# EasyEDA Pro project delay_module_easyeda.epro

# Schematic Schematic1
Board Name: Board1; Create Date: 2026-01-04; Page Name: P1; Project Name: delay module; Schematic Name: Schematic1; Update Date: 2026-01-04; Company: EasyEDA.com; Page Size: A4; Version: V1.0
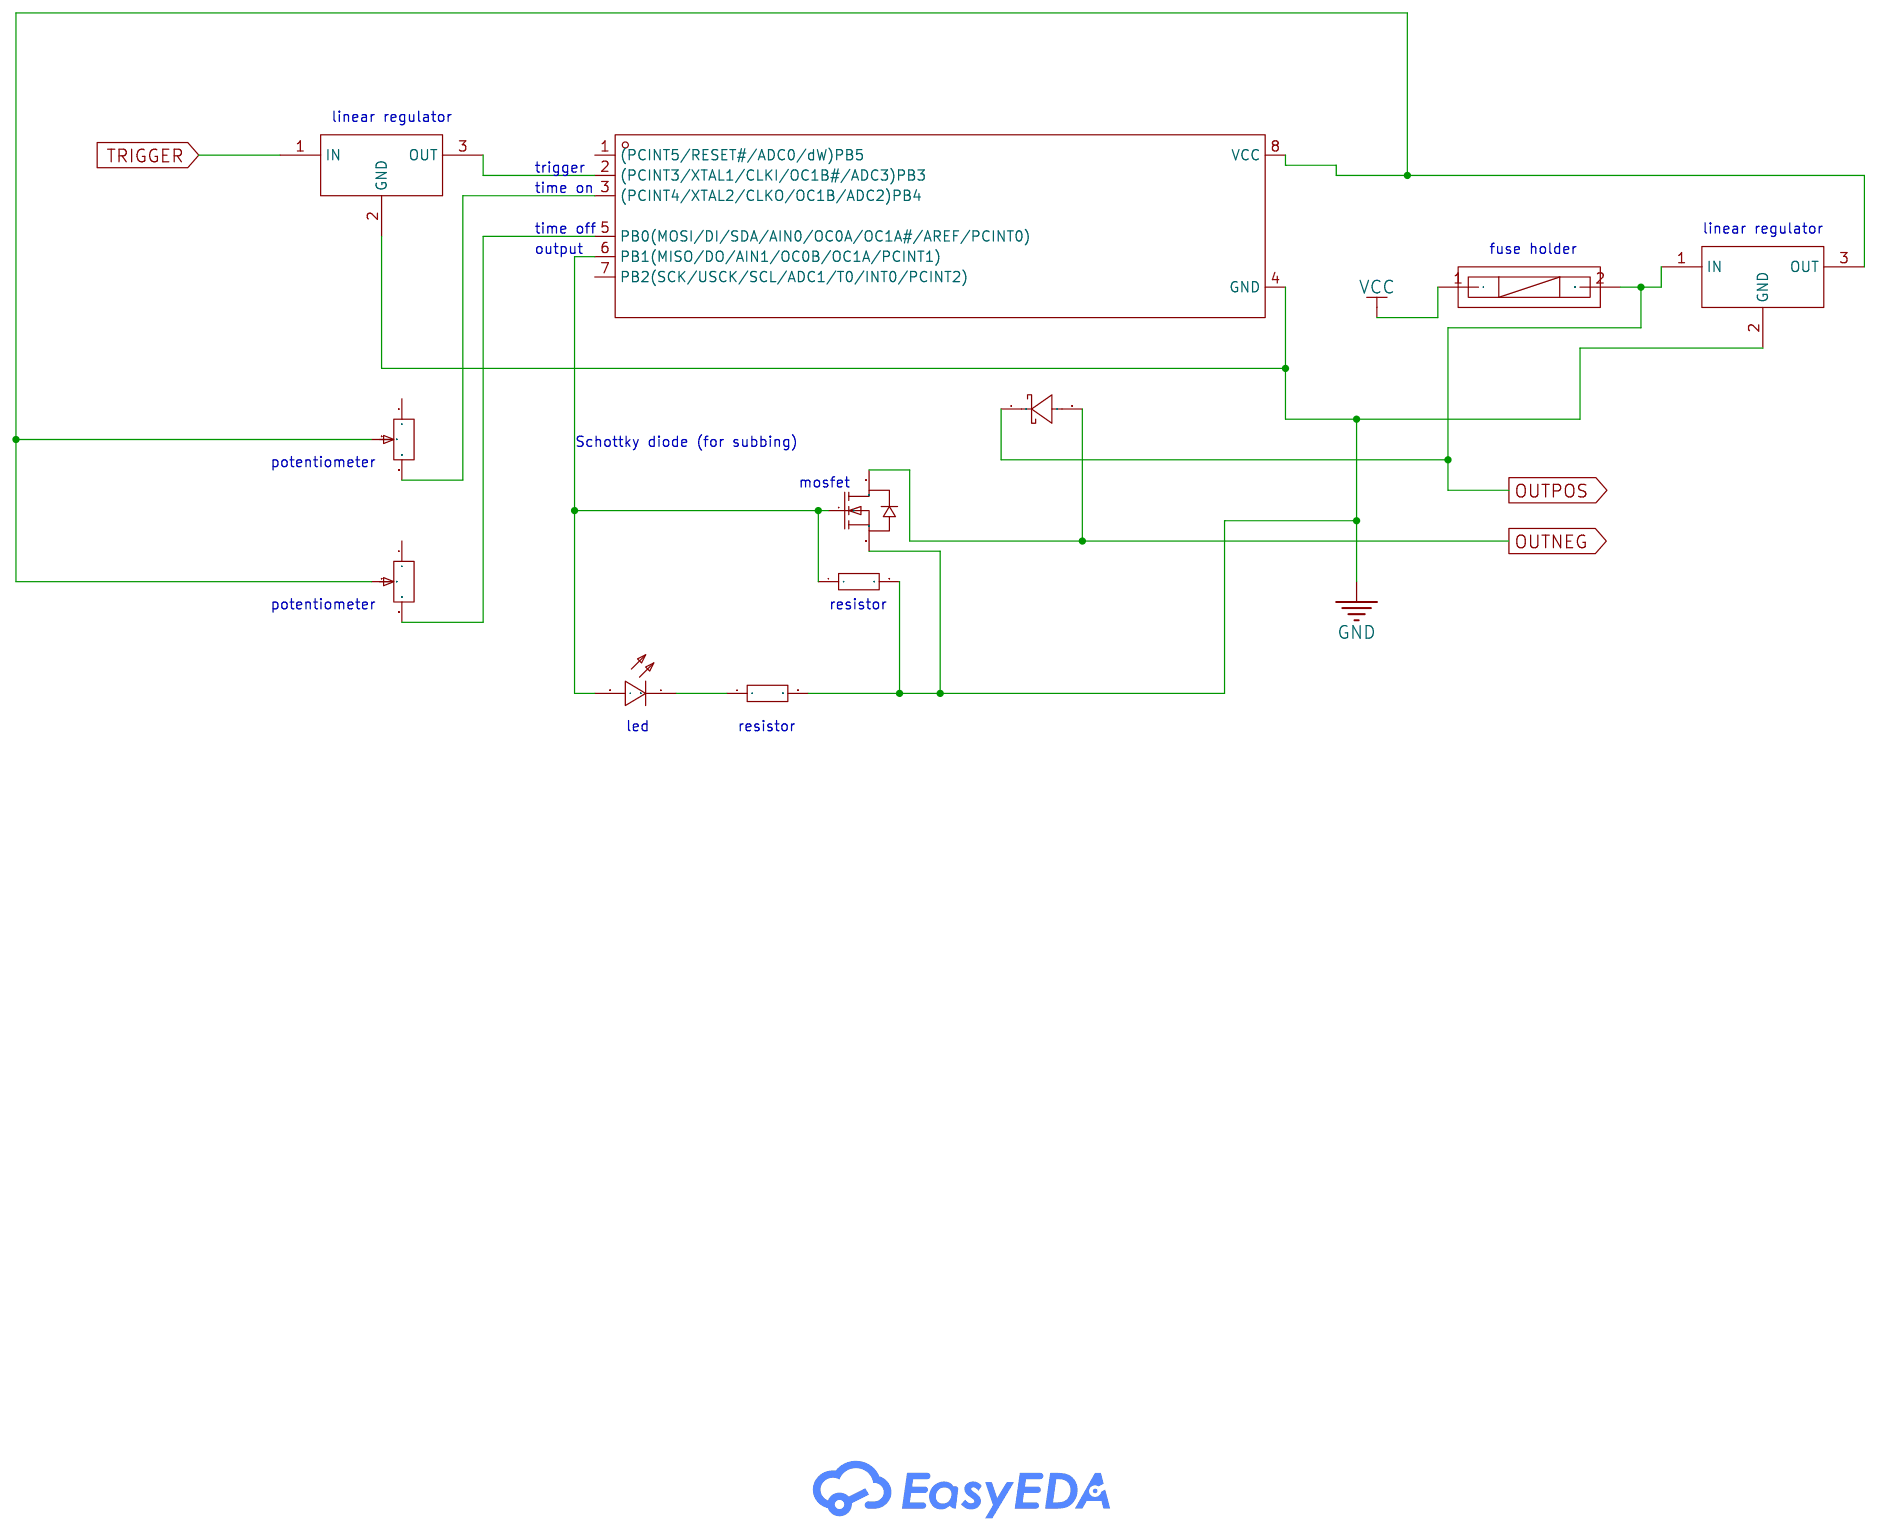
[diagram p0: schematic sheet]

## Parts
D1  1N5819  [DO-41_BD2.4-L4.7-P8.70-D0.8-RD]
F1  5x20 BLX-A型 保险丝支架 XC-7  [FUSE-TH_L22.6-W9.0]
IR1  IR908-7C(E5)  [LED-TH_L4.5-W1.5-P2.54-RD]
Q1  FQP30N06L-VB  [TO-220AB-3_L10.3-W5.0-P2.54-L]
R1  10K  [R0603]
R2  10kΩ  [RES-ADJ-TH_RK097111080J]
R3  10kΩ  [RES-ADJ-TH_RK097111080J]
R4  10K  [R0603]
U1  ATTINY85-20PU  [PDIP-8_L9.3-W6.4-P2.54-LS7.9-BL-1]
U2  L7805CV  [TO-220-3_L10.0-W4.5-P2.54-L]
U3  L7805CV  [TO-220-3_L10.0-W4.5-P2.54-L]

## Library data of the parts
D1 = 1N5819_C49318088: Voltage - Forward(Vf@If):600mV@1A Voltage - DC Reverse(Vr):40V Current - Rectified:1A Reverse Leakage Current (Ir):500uA Operating Junction Temperature Range:-55℃~+125℃ Operating Junction Temperature Range:-55℃~+125℃ Non-Repetitive Peak Forward Surge Curr; LCSC Part Name: 肖特基二极管; Supplier Part: C49318088; Manufacturer: luJing(鲁晶); Supplier Footprint: DO-41; JLCPCB Part Class: Extended Part; Datasheet: https://item.szlcsc.com/datasheet/1N5819/51789330.html; Supplier: LCSC; Voltage - Forward(Vf@If): 600mV@1A; Voltage - DC Reverse(Vr): 40V; Current - Rectified: 1A; Reverse Leakage Current (Ir): 500uA; Operating Junction Temperature Range: -55℃~+125℃; Non-Repetitive Peak Forward Surge Current: 25A
F1 = 5x20 BLX-A型 保险丝支架 XC-7: Fuseholder Type:Bracket type Number of Circuits:1 Voltage Rating:250V Current Rating:6.3A Fuse Type:Cylindrical Fuse Diameter (φD):5.2mm Fuse Length:20mm; LCSC Part Name: 保险丝座 5x20 BLX-A型; Supplier Part: C3131; Manufacturer: xcfuse(旭程); Supplier Footprint: 插件; JLCPCB Part Class: Extended Part; Datasheet: https://item.szlcsc.com/datasheet/5x20%2520BLX-A%25E5%259E%258B%2520%25E4%25BF%259D%25E9%2599%25A9%25E4%25B8%259D%25E6%2594%25AF%25E6%259E%25B6%2520XC-7/3520.html; Supplier: LCSC; Fuseholder Type: Bracket type; Number of Circuits: 1; Voltage Rating: 250V; Current Rating: 6.3A; Fuse Type: Cylindrical; Fuse Diameter (φD): 5.2mm; Fuse Length: 20mm
IR1 = IR908-7C(E5): Radiant Intensity:; Supplier Part: C72054; Manufacturer: EVERLIGHT(亿光); Supplier Footprint: 插件,L=4.5mm; JLCPCB Part Class: Extended Part; Datasheet: https://atta.szlcsc.com/upload/public/pdf/source/20160507/1462613614332.pdf; Supplier: LCSC
Q1 = FQP30N06L-VB: Number:One N-channel Drain to Source Voltage:60V Current - Continuous Drain(Id):50A RDS(on):24mΩ@10V Pd - Power Dissipation:150W Gate Threshold Voltage (Vgs(th)):4V Gate Charge(Qg):28nC@10V Input Capacitance(Ciss):1.3nF@25V Reverse Transfer Capacitance (C; LCSC Part Name: 1个N沟道 耐压:60V 电流:50A; Supplier Part: C878826; Manufacturer: VBsemi(微碧半导体); Supplier Footprint: TO-220AB; JLCPCB Part Class: Extended Part; Datasheet: https://item.szlcsc.com/datasheet/FQP30N06L-VB/938801.html; Supplier: LCSC; Number: One N-channel; Drain to Source Voltage: 60V; Current - Continuous Drain(Id): 50A; RDS(on): 24mΩ@10V; Pd - Power Dissipation: 150W; Gate Threshold Voltage (Vgs(th)): 4V; Gate Charge(Qg): 28nC@10V; Input Capacitance(Ciss): 1.3nF@25V; Reverse Transfer Capacitance (Crss@Vds): 110pF@25V; Operating Temperature: -55℃~+175℃; Type: N-Channel
R1 R4 = Res_0603: Supplier Footprint: 0603
R2 R3 = RK097111080J: Resistance:10kΩ; LCSC Part Name: 三件套 10kΩ 旋转电位器，水平安装，螺纹固定，总阻值10kΩ; Supplier Part: C97444; Manufacturer: ALPSALPINE(阿尔卑斯阿尔派); Supplier Footprint: 插件; JLCPCB Part Class: Extended Part; Datasheet: https://atta.szlcsc.com/upload/public/pdf/source/20170325/1490427936259.pdf; Supplier: LCSC
U1 = ATTINY85-20PU: CPU Core:AVR CPU Maximum Speed:20MHz Program Storage Size:8KB Program Memory Type:FLASH EEPROM:512Byte Number of I/O:6 ADC (Bit):10bit Voltage - Supply:2.7V~5.5V Voltage - Supply:2.7V~5.5V Applications:-; Supplier Part: C965497; Manufacturer: MICROCHIP(美国微芯); Supplier Footprint: PDIP-8; JLCPCB Part Class: Extended Part; Datasheet: https://item.szlcsc.com/datasheet/ATTINY85-20PU/1052792.html; Supplier: LCSC; CPU Core: AVR; CPU Maximum Speed: 20MHz; Program Storage Size: 8KB; Program Memory Type: FLASH; EEPROM: 512Byte; Number of I/O: 6; ADC (Bit): 10bit; Voltage - Supply: 2.7V~5.5V
U2 U3 = L7805CV_C6430948: Output Type:Fixed Voltage - Supply:20V Output Voltage:5V Output Voltage:5V Output Current:1.5A Voltage Dropout:100mV@(1A) standby current:9mA Features:Short Circuit Protection；Over Temperature Protection Operating Temperature:0℃~+125℃ Operating Temperatur; LCSC Part Name: 线性稳压器 1.5A 5V; Supplier Part: C6430948; Manufacturer: GOODWORK(固得沃克); Supplier Footprint: TO-220AB; JLCPCB Part Class: Extended Part; Datasheet: https://item.szlcsc.com/datasheet/L7805CV/7383833.html; Supplier: LCSC; Output Type: Fixed; Voltage - Supply: 20V; Output Voltage: 5V; Output Current: 1.5A; Voltage Dropout: 100mV@(1A); standby current: 9mA; Features: Short Circuit Protection；Over Temperature Protection; Operating Temperature: 0℃~+125℃; Output Configuration: Positive; Number of Outputs: 1

## Nets
GND: Q1.3(S) R1.2 R4.2 U1.4(GND) U2.2(GND) U3.2(GND)
VCC: F1.1
OUTNEG: D1.2(A) Q1.2(D)
OUTPOS: D1.1(C) F1.2 U3.1(IN)
TRIGGER: U2.1(IN)
Net-(IR1-1): IR1.1(C) R4.1
Net-(IR1-2): IR1.2(A) Q1.1(G) R1.1 U1.6(PB1(MISO/DO/AIN1/OC0B/OC1A/PCINT1))
Net-(R2-2): R2.2 R3.2 U1.8(VCC) U3.3(OUT)
Net-(R2-3): R2.3 U1.3((PCINT4/XTAL2/CLKO/OC1B/ADC2)PB4)
Net-(R3-3): R3.3 U1.5(PB0(MOSI/DI/SDA/AIN0/OC0A/OC1A#/AREF/PCINT0))
Net-(U1-2): U1.2((PCINT3/XTAL1/CLKI/OC1B#/ADC3)PB3) U2.3(OUT)

Not connected (* = marked no-connect by the designer): R2 1; R3 1; U1 1((PCINT5/RESET#/ADC0/dW)PB5) 7(PB2(SCK/USCK/SCL/ADC1/T0/INT0/PCINT2))

## Notes on the sheet
- linear regulator
- trigger
- time on
- time off
- linear regulator
- output
- fuse holder
- Schottky diode (for subbing)
- potentiometer
- mosfet
- potentiometer
- resistor
- led
- resistor

# Board boardver1
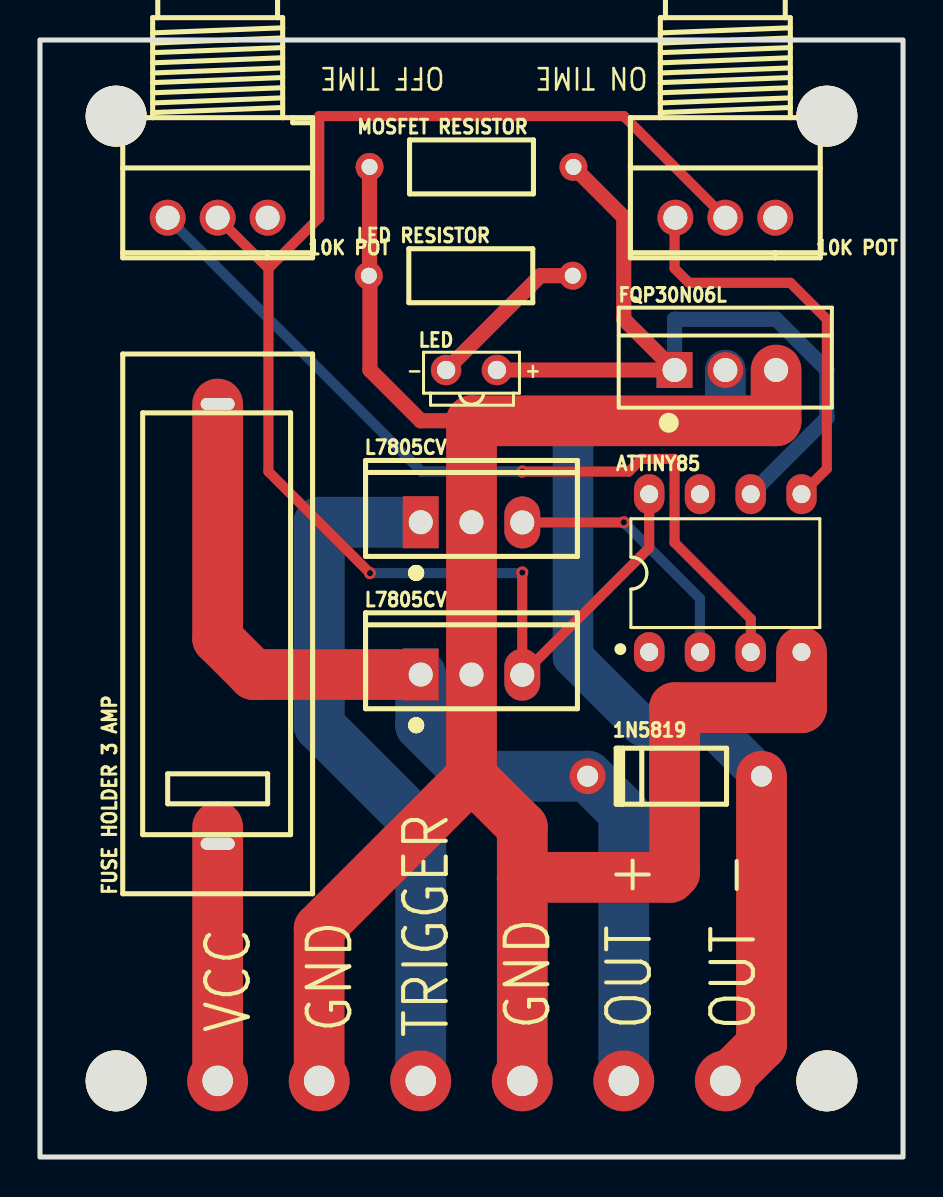
[diagram p1: board, top side]
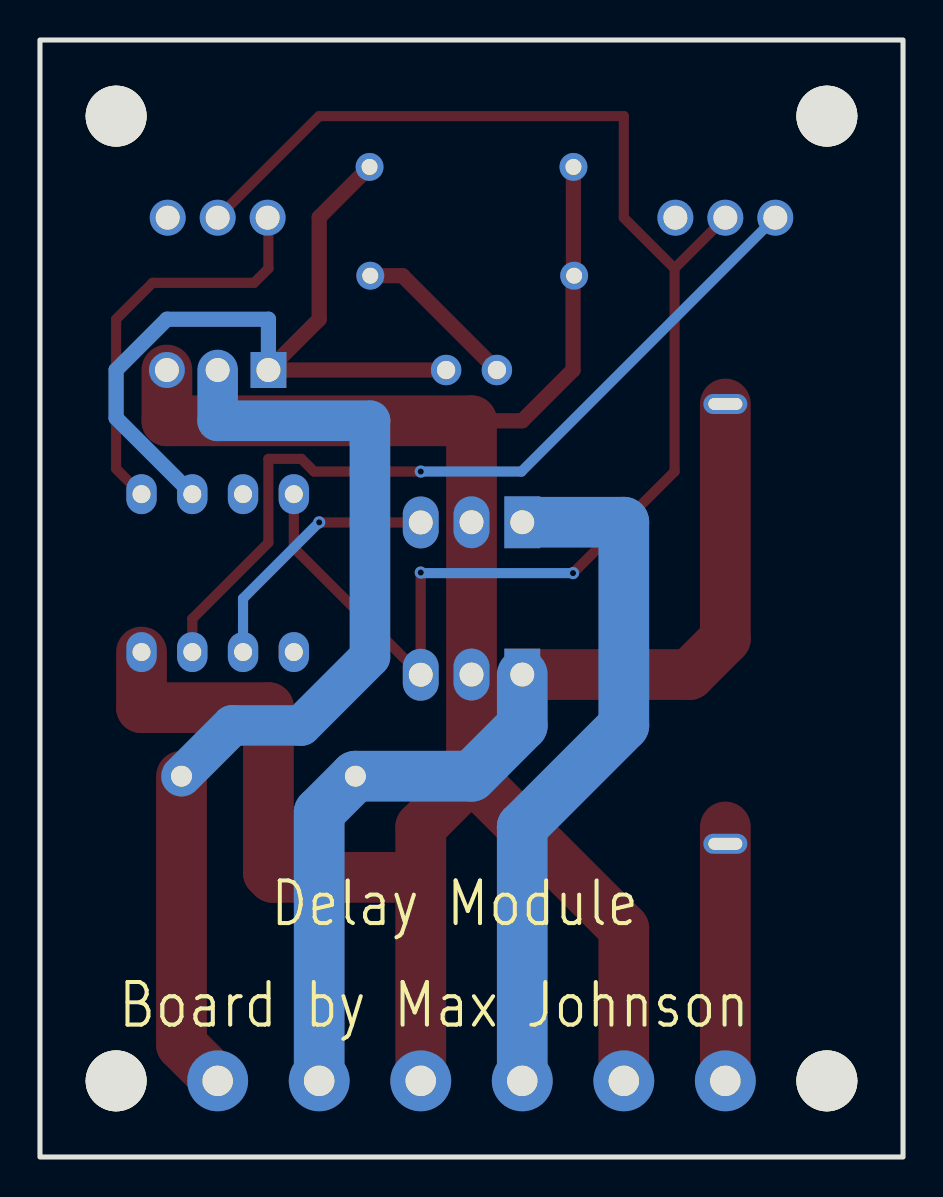
[diagram p2: board, bottom side, seen from below]

Outline 43.18 x 55.88 mm; copper layers: Top Layer, Bottom Layer. Coordinates in mm from the lower left corner of the outline.
Outline path: rectangle 0,55.88 43.18,0
Stack: Top Layer 0.035mm / Dielectric1 1.51mm FR4 er 4.5 / Bottom Layer 0.035mm

## Design rules (mm)
template: JLCPCB Capability(Two Layers Board)
spacing copperThickness1oz (default): track to track 0.102, other pairs 0.152 to 0.3
spacing copperThickness2oz: track to track 0.203, other pairs 0.152 to 0.3
track width copperThickness1oz (default): min 0.127, default 0.254, max 2.54
track width copperThickness2oz: min 0.203, default 0.254, max 2.54
differential pair differentialPair (default): width min 0.127, default 0.254, max 2.54; gap min 0.152, default 0.152
via viaSize (default): diameter min 0.5, default 0.61, max 10; hole min 0.3, default 0.305, max 6.3

## Placement (name value [footprint] x y rotation side)
1N5819  1N5819  [DO-41_BD2.4-L4.7-P8.70-D0.8-RD]  31.75 19.05 0 top
10K POT  -  [RES-ADJ-TH_RK097111080J]  8.89 46.99 180 top
10K POT#2  -  [RES-ADJ-TH_RK097111080J]  34.29 46.99 180 top
ATTINY85  ATTINY85-20PU  [PDIP-8_L9.3-W6.4-P2.54-LS7.9-BL-1]  34.29 29.21 0 top
FQP30N06L  FQP30N06L-VB  [TO-220AB-3_L10.3-W5.0-P2.54-L]  34.29 39.37 0 top
FUSE HOLDER 3 AMP  5x20 BLX-A型 保险丝支架 XC-7  [FUSE-TH_L22.6-W9.0]  8.89 26.67 90 top
L7805CV  -  [TO-220-3_L10.0-W4.5-P2.54-L]  21.59 24.13 0 top
L7805CV#2  -  [TO-220-3_L10.0-W4.5-P2.54-L]  21.59 31.75 0 top
LED  IR908-7C(E5)  [LED-TH_L4.5-W1.5-P2.54-RD]  21.59 39.37 0 top
LED RESISTOR  10kΩ  [RES-TH_BD2.7-L6.2-P10.20-D0.4]  21.55 44.09 0 top
MOSFET RESISTOR  10kΩ  [RES-TH_BD2.7-L6.2-P10.20-D0.4]  21.59 49.53 0 top
NOREF  -  [Pad_e15]  29.21 3.81 0 top
NOREF#2  -  [Pad_e13]  19.05 3.81 0 top
NOREF#3  -  [Pad_e12]  13.97 3.81 0 top
NOREF#4  -  [Pad_e14]  24.13 3.81 0 top
NOREF#5  -  [Pad_e421]  39.37 3.81 0 top
NOREF#6  -  [Pad_e419]  39.37 52.07 0 top
NOREF#7  -  [Pad_e25]  34.29 3.81 0 top
NOREF#8  -  [Pad_e418]  3.81 52.07 0 top
NOREF#9  -  [Pad_e11]  8.89 3.81 0 top
NOREF#10  -  [Pad_e420]  3.81 3.81 0 top

## Footprints (pads in the part's own frame, mm; a bottom-side part is the same pattern mirrored in y, then rotated)
DO-41_BD2.4-L4.7-P8.70-D0.8-RD
  round 1.8 hole 1.05: 1(-4.35,0) 2(4.35,0)
FUSE-TH_L22.6-W9.0
  oval 1x2.2 hole 0.6x1.7: 1(-11,0) 2(11,0)
LED-TH_L4.5-W1.5-P2.54-RD
  round 1.524 hole 0.914: 1(-1.27,0) 2(1.27,0)
Pad_e11
  round 3.048 hole 1.524: 1(0,0)
Pad_e12
  round 3.048 hole 1.524: 2(0,0)
Pad_e13
  round 3.048 hole 1.524: 3(0,0)
Pad_e14
  round 3.048 hole 1.524: 4(0,0)
Pad_e15
  round 3.048 hole 1.524: 5(0,0)
Pad_e25
  round 3.048 hole 1.524: 6(0,0)
Pad_e418
  round 3.048 hole 3.048: 1(0,0)
Pad_e419
  round 3.048 hole 3.048: 2(0,0)
Pad_e420
  round 3.048 hole 3.048: 3(0,0)
Pad_e421
  round 3.048 hole 3.048: 4(0,0)
PDIP-8_L9.3-W6.4-P2.54-LS7.9-BL-1
  oval 1.524x2 hole 0.9: 1(-3.81,-3.95) 2(-1.27,-3.95) 3(1.27,-3.95) 4(3.81,-3.95) 5(3.81,3.95) 6(1.27,3.95) 7(-1.27,3.95) 8(-3.81,3.95)
RES-ADJ-TH_RK097111080J
  round 1.8 hole 1.2: 1(-2.5,0) 2(0,0) 3(2.5,0)
RES-TH_BD2.7-L6.2-P10.20-D0.4
  round 1.4 hole 0.8: 1(-5.1,0) 2(5.1,0)
TO-220-3_L10.0-W4.5-P2.54-L
  rect 1.8x2.6 hole 1.2: 1(-2.54,0.005)
  oval 1.8x2.6 hole 1.2: 2(0,0.005) 3(2.54,-0.005)
TO-220AB-3_L10.3-W5.0-P2.54-L
  rect 1.8x1.8 hole 1.2: 1(-2.54,0)
  round 1.8 hole 1.2: 2(0,0) 3(2.54,0)

## Nets
VCC: FUSE HOLDER 3 AMP.1
OUTNEG: 1N5819.2 ATTINY85.4 FQP30N06L.2 FQP30N06L.3 L7805CV.2 L7805CV#2.2 NOREF#3.2 NOREF#4.4 NOREF#7.6
OUTPOS: 1N5819.1 FUSE HOLDER 3 AMP.2 L7805CV.1 NOREF.5
TRIGGER: L7805CV#2.1 NOREF#2.3
$1N1277: 10K POT.2 10K POT#2.2 ATTINY85.8 L7805CV.3
$1N1425: ATTINY85.2 L7805CV#2.3
$1N1430: 10K POT.3 ATTINY85.3
$1N1436: 10K POT#2.3 ATTINY85.5
$1N1491: ATTINY85.6 FQP30N06L.1 LED.2
$1N1583: LED.1

Pads without a net: 10K POT 1; 10K POT#2 1; ATTINY85 1 7; LED RESISTOR 1 2; MOSFET RESISTOR 1 2; NOREF#5 4; NOREF#6 2; NOREF#8 1; NOREF#9 1; NOREF#10 3

## Via types
v1: diameter 0.61, hole 0.305, Top Layer to Bottom Layer, 5 vias

## Routing (per net, layer and track width the routed paths; a pad name or vN(x,y) marks a point on that pad's centre or on a via; arc(x,y) is an arc through that point)
GND: length 95.4
  Top Layer w2.54: 24.13,13.99 24.13,16.51 21.59,19.05 ; 24.13,13.99 24.13,3.81 ; 24.13,13.99 31.53,13.99 31.75,14.21 31.75,22.48 38.1,22.48 38.1,25.26 ; 21.59,19.05 13.97,11.43 13.97,3.81 ; 21.59,19.05 21.59,36.83 36.83,36.83 36.83,39.37
(no net): length 29
  Top Layer w0.762: MOSFET RESISTOR.1 16.49,44.05 16.51,44.03 16.51,39.37 19.05,36.83 21.59,36.83
  Top Layer w2.54: NOREF#9.1 8.89,16.51
OUTNEG: length 49.9
  Top Layer w2.54: 1N5819.2 36.1,5.62 NOREF#7.6
  Bottom Layer w2.032: 1N5819.2 33.56,21.59 30.1,21.59 26.67,25.02 26.67,36.83 34.29,36.83 FQP30N06L.2
OUTPOS: length 49.6
  Top Layer w2.54: FUSE HOLDER 3 AMP.2 8.89,25.93 10.69,24.14 18.03,24.14
  Bottom Layer w2.54: NOREF.5 29.21,17.24 1N5819.1 21.59,19.05 19.05,21.59 L7805CV.1
TRIGGER: length 34.1
  Bottom Layer w2.54: 18.03,31.76 13.97,31.76 13.97,21.59 19.05,16.51 NOREF#2.3
$1N1277: length 76.4
  Top Layer w0.508: ATTINY85.8 30.48,30.48 L7805CV.3 v1(24.13,29.24) ; 10K POT#2.2 29.21,52.07 13.97,52.07 13.97,46.99 11.43,44.45 ; 11.43,44.45 10K POT.2 ; 11.43,44.45 11.43,34.29 v1(16.51,29.21)
  Bottom Layer w0.508: v1(16.51,29.21) 24.1,29.21 v1(24.13,29.24)
$1N1425: length 13.2
  Top Layer w0.508: v1(29.21,31.75) 29.2,31.75 L7805CV#2.3
  Bottom Layer w0.508: ATTINY85.2 33.02,27.94 v1(29.21,31.75)
$1N1430: length 42.1
  Top Layer w0.508: v1(24.13,34.29) 29.46,34.29 30.1,34.93 31.75,34.93 31.75,30.73 35.56,26.92 ATTINY85.3
  Bottom Layer w0.508: 10K POT.3 19.09,34.29 v1(24.13,34.29)
$1N1436: length 20.5
  Top Layer w0.508: 10K POT#2.3 31.75,46.95 31.75,44.45 32.47,43.73 37.55,43.73 39.37,41.91 39.37,34.43 ATTINY85.5
$1N1491: length 40.1
  Top Layer w0.762: LED.2 FQP30N06L.1 29.21,41.91 29.21,47.01 26.69,49.53
  Bottom Layer w0.762: FQP30N06L.1 31.75,41.91 36.83,41.91 39.37,39.37 39.37,36.97 ATTINY85.6
$1N1583: length 8.3
  Top Layer w0.762: LED.1 25.04,44.09 v1(26.66,44.09)

## Text on the board
Bottom Silkscreen Layer: Delay Module | Board by Max Johnson
Top Silkscreen Layer: - | + | ON TIME | OFF TIME | VCC | GND | TRIGGER | OUT + | OUT -

# Board boardver2
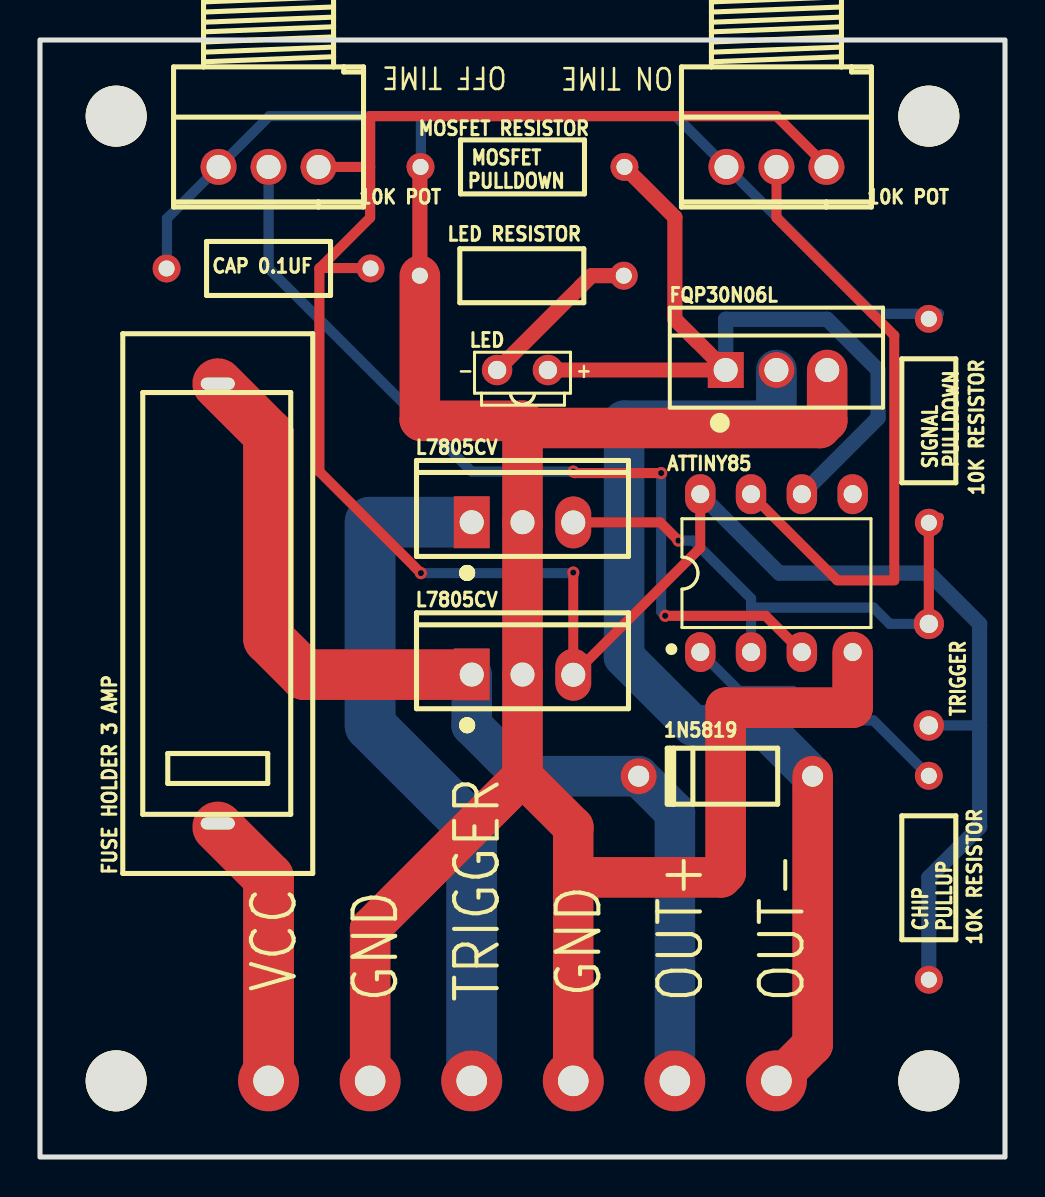
[diagram p3: board, top side]
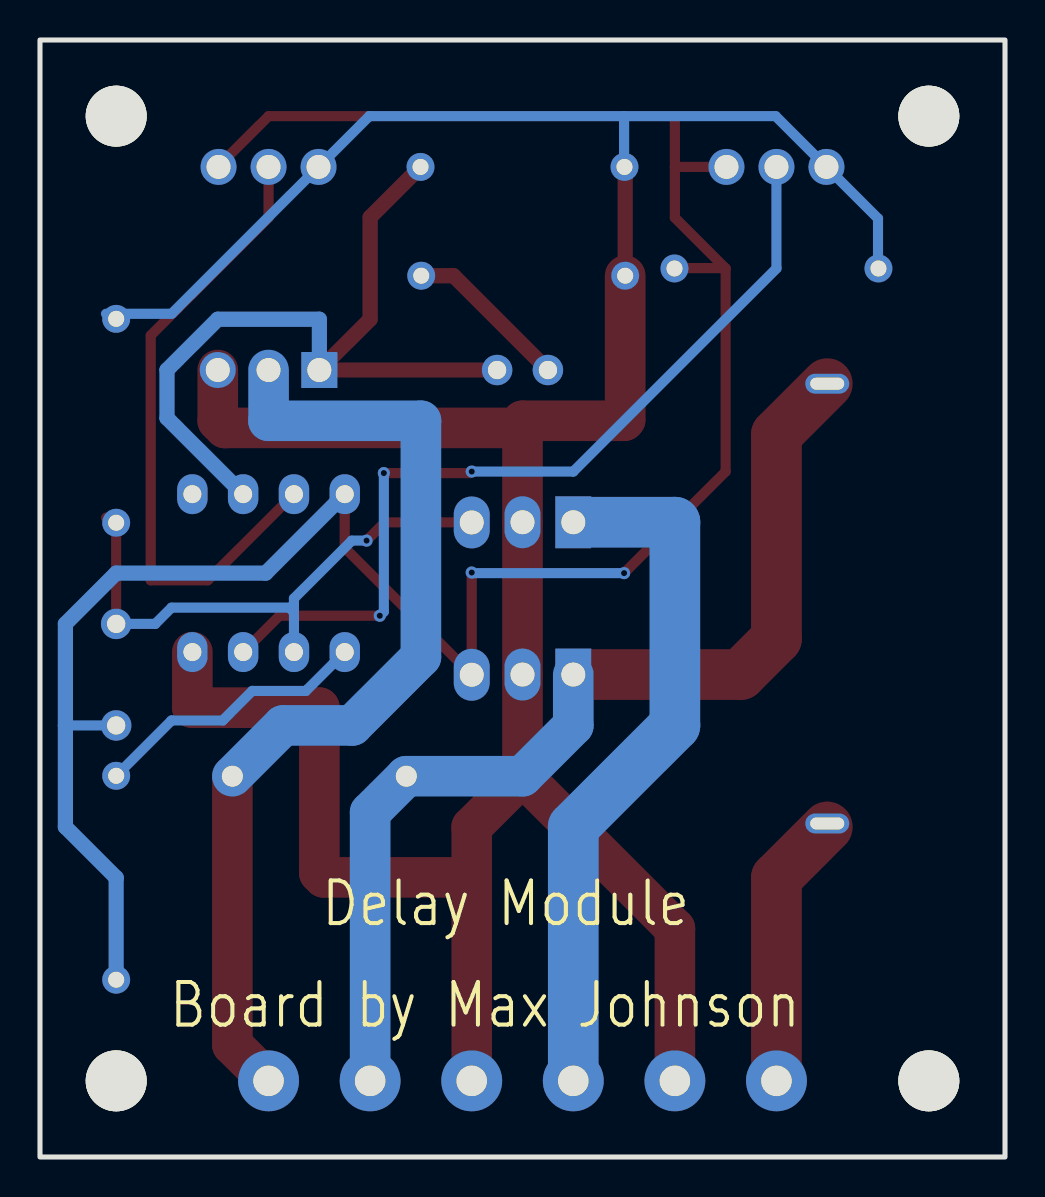
[diagram p4: board, bottom side, seen from below]

Outline 48.26 x 55.88 mm; copper layers: Top Layer, Bottom Layer. Coordinates in mm from the lower left corner of the outline.
Outline path: rectangle 0,55.88 48.26,0
Stack: Top Layer 0.035mm / Dielectric1 1.51mm FR4 er 4.5 / Bottom Layer 0.035mm

## Design rules (mm)
template: JLCPCB Capability(Two Layers Board)
spacing copperThickness1oz (default): track to track 0.102, other pairs 0.152 to 0.3
spacing copperThickness2oz: track to track 0.203, other pairs 0.152 to 0.3
track width copperThickness1oz (default): min 0.127, default 0.254, max 2.54
track width copperThickness2oz: min 0.203, default 0.254, max 2.54
differential pair differentialPair (default): width min 0.127, default 0.254, max 2.54; gap min 0.152, default 0.152
via viaSize (default): diameter min 0.5, default 0.61, max 10; hole min 0.3, default 0.305, max 6.3

## Placement (name value [footprint] x y rotation side)
1N5819  1N5819  [DO-41_BD2.4-L4.7-P8.70-D0.8-RD]  34.29 19.05 0 top
10K POT  -  [RES-ADJ-TH_RK097111080J]  36.83 49.53 180 top
10K POT#2  -  [RES-ADJ-TH_RK097111080J]  11.43 49.53 180 top
10K RESISTOR  -  [RES-TH_BD2.7-L6.2-P10.20-D0.4]  44.45 13.97 90 top
10K RESISTOR#2  -  [RES-TH_BD2.7-L6.2-P10.20-D0.4]  44.45 36.83 90 top
ATTINY85  ATTINY85-20PU  [PDIP-8_L9.3-W6.4-P2.54-LS7.9-BL-1]  36.83 29.21 0 top
CAP 0.1UF  10kΩ  [RES-TH_BD2.7-L6.2-P10.20-D0.4]  11.43 44.45 0 top
FQP30N06L  FQP30N06L-VB  [TO-220AB-3_L10.3-W5.0-P2.54-L]  36.83 39.37 0 top
FUSE HOLDER 3 AMP  5x20 BLX-A型 保险丝支架 XC-7  [FUSE-TH_L22.6-W9.0]  8.89 27.69 90 top
L7805CV  -  [TO-220-3_L10.0-W4.5-P2.54-L]  24.13 24.13 0 top
L7805CV#2  -  [TO-220-3_L10.0-W4.5-P2.54-L]  24.13 31.75 0 top
LED  IR908-7C(E5)  [LED-TH_L4.5-W1.5-P2.54-RD]  24.13 39.37 0 top
LED RESISTOR  10kΩ  [RES-TH_BD2.7-L6.2-P10.20-D0.4]  24.09 44.09 0 top
MOSFET RESISTOR  10kΩ  [RES-TH_BD2.7-L6.2-P10.20-D0.4]  24.13 49.53 0 top
NOREF  -  [Pad_e25]  36.83 3.81 0 top
NOREF#2  -  [Pad_e13]  21.59 3.81 0 top
NOREF#3  -  [Pad_e4]  44.45 26.67 0 top
NOREF#4  -  [Pad_e15]  31.75 3.81 0 top
NOREF#5  -  [Pad_e11]  11.43 3.81 0 top
NOREF#6  -  [Pad_e421]  44.45 3.81 0 top
NOREF#7  -  [Pad_e12]  16.51 3.81 0 top
NOREF#8  -  [Pad_e420]  3.81 3.81 0 top
NOREF#9  -  [Pad_e418]  3.81 52.07 0 top
NOREF#10  -  [Pad_e419]  44.45 52.07 0 top
NOREF#11  -  [Pad_e14]  26.67 3.81 0 top
NOREF#12  -  [Pad_e7]  44.45 21.59 0 top

## Footprints (pads in the part's own frame, mm; a bottom-side part is the same pattern mirrored in y, then rotated)
DO-41_BD2.4-L4.7-P8.70-D0.8-RD
  round 1.8 hole 1.05: 1(-4.35,0) 2(4.35,0)
FUSE-TH_L22.6-W9.0
  oval 1x2.2 hole 0.6x1.7: 1(-11,0) 2(11,0)
LED-TH_L4.5-W1.5-P2.54-RD
  round 1.524 hole 0.914: 1(-1.27,0) 2(1.27,0)
Pad_e4
  round 1.524 hole 0.914: 1(0,0)
Pad_e7
  round 1.524 hole 0.914: 2(0,0)
Pad_e11
  round 3.048 hole 1.524: 1(0,0)
Pad_e12
  round 3.048 hole 1.524: 2(0,0)
Pad_e13
  round 3.048 hole 1.524: 3(0,0)
Pad_e14
  round 3.048 hole 1.524: 4(0,0)
Pad_e15
  round 3.048 hole 1.524: 5(0,0)
Pad_e25
  round 3.048 hole 1.524: 6(0,0)
Pad_e418
  round 3.048 hole 3.048: 1(0,0)
Pad_e419
  round 3.048 hole 3.048: 2(0,0)
Pad_e420
  round 3.048 hole 3.048: 3(0,0)
Pad_e421
  round 3.048 hole 3.048: 4(0,0)
PDIP-8_L9.3-W6.4-P2.54-LS7.9-BL-1
  oval 1.524x2 hole 0.9: 1(-3.81,-3.95) 2(-1.27,-3.95) 3(1.27,-3.95) 4(3.81,-3.95) 5(3.81,3.95) 6(1.27,3.95) 7(-1.27,3.95) 8(-3.81,3.95)
RES-ADJ-TH_RK097111080J
  round 1.8 hole 1.2: 1(-2.5,0) 2(0,0) 3(2.5,0)
RES-TH_BD2.7-L6.2-P10.20-D0.4
  round 1.4 hole 0.8: 1(-5.1,0) 2(5.1,0)
TO-220-3_L10.0-W4.5-P2.54-L
  rect 1.8x2.6 hole 1.2: 1(-2.54,0.005)
  oval 1.8x2.6 hole 1.2: 2(0,0.005) 3(2.54,-0.005)
TO-220AB-3_L10.3-W5.0-P2.54-L
  rect 1.8x1.8 hole 1.2: 1(-2.54,0)
  round 1.8 hole 1.2: 2(0,0) 3(2.54,0)

## Nets
5V POWER: 10K POT.1 10K POT#2.1 10K RESISTOR.1 ATTINY85.8 CAP 0.1UF.2 L7805CV.3 NOREF#12.2
GND: 10K POT.3 10K POT#2.3 10K RESISTOR#2.2 ATTINY85.4 CAP 0.1UF.1 FQP30N06L.3 L7805CV.2 L7805CV#2.2 LED RESISTOR.1 MOSFET RESISTOR.1 NOREF#7.2 NOREF#11.4
FUSED_POWER: 1N5819.1 FUSE HOLDER 3 AMP.2 L7805CV.1 NOREF#4.5
INPUT_POWER: FUSE HOLDER 3 AMP.1 NOREF#5.1
LED_GND: LED.1 LED RESISTOR.2
OFF_TIME_SENSOR: 10K POT#2.2 ATTINY85.3
ON_TIME_SENSOR: 10K POT.2 ATTINY85.7
OUTNEG: 1N5819.2 FQP30N06L.2 NOREF.6
OUTPUT_CONTROL: ATTINY85.6 FQP30N06L.1 LED.2 MOSFET RESISTOR.2
PULLUP: 10K RESISTOR.2 ATTINY85.1
SIGNAL: 10K RESISTOR#2.1 ATTINY85.2 L7805CV#2.3 NOREF#3.1
TRIGGER: L7805CV#2.1 NOREF#2.3
UNUSED: ATTINY85.5

Pads without a net: NOREF#6 4; NOREF#8 3; NOREF#9 1; NOREF#10 2

## Via types
v1: diameter 0.61, hole 0.305, Top Layer to Bottom Layer, 6 vias

## Routing (per net, layer and track width the routed paths; a pad name or vN(x,y) marks a point on that pad's centre or on a via; arc(x,y) is an arc through that point)
5V POWER: length 117.5
  Top Layer w0.508: 39.37,49.53 36.83,52.07 16.51,52.07 16.51,49.53 ; CAP 0.1UF.2 16.51,44.47 13.99,44.47 ; 10K POT#2.1 16.51,49.53 ; 16.51,49.53 16.51,46.99 13.99,44.47 ; v1(26.67,29.24) L7805CV.3 33.02,30.48 ATTINY85.8 ; 13.99,44.47 13.97,44.45 13.97,34.29 v1(19.05,29.21)
  Bottom Layer w0.508: NOREF#12.2 46.99,21.59 ; v1(26.67,29.24) 26.64,29.21 v1(19.05,29.21)
  Bottom Layer w0.762: 44.45,8.89 44.45,13.98 46.99,16.52 46.99,26.67 44.45,29.21 36.97,29.21 ATTINY85.8
GND: length 163.2
  Top Layer w0.762: 18.99,49.53 LED RESISTOR.1
  Top Layer w2.032: FQP30N06L.3 39.37,36.83 39.01,36.47 24.13,36.47 ; 26.67,13.99 26.67,16.51 24.13,19.05 ; 26.67,13.99 34.07,13.99 34.29,14.21 34.29,22.48 40.64,22.48 ATTINY85.4 ; 26.67,13.99 NOREF#11.4 ; 24.13,19.05 16.51,11.43 NOREF#7.2 ; 24.13,19.05 L7805CV.2 L7805CV#2.2 24.13,36.83 19.05,36.83 18.99,36.89 LED RESISTOR.1
  Bottom Layer w0.508: 6.35,44.45 6.35,46.95 10K POT#2.3 11.47,52.07 19.05,52.07 ; 19.05,52.07 31.79,52.07 10K POT.3 41.68,42.18 44.96,42.18 ; 19.05,52.07 19.05,49.55 MOSFET RESISTOR.1
FUSED_POWER: length 51.6
  Top Layer w2.54: 20.57,24.14 13.23,24.14 11.43,25.93 11.43,36.15 FUSE HOLDER 3 AMP.2
  Bottom Layer w2.032: L7805CV.1 21.59,21.59 24.13,19.05 1N5819.1 31.75,17.24 NOREF#4.5
INPUT_POWER: length 13.8
  Top Layer w2.54: 8.89,16.51 11.43,13.97 NOREF#5.1
LED_GND: length 8.3
  Top Layer w0.762: LED RESISTOR.2 27.58,44.09 LED.1
OFF_TIME_SENSOR: length 43.8
  Top Layer w0.508: v1(31.06,34.21) 26.75,34.21 v1(26.67,34.29) ; ATTINY85.3 36.28,27.08 v1(31.27,27.08)
  Bottom Layer w0.508: v1(31.27,27.08) 31.06,27.28 v1(31.06,34.21) ; 10K POT#2.2 11.43,44.45 21.59,34.29 v1(26.67,34.29)
ON_TIME_SENSOR: length 32.1
  Top Layer w0.508: ATTINY85.7 39.87,28.85 42.72,28.85 42.72,41.1 36.83,46.99 10K POT.2
OUTNEG: length 49.9
  Top Layer w2.032: 1N5819.2 38.64,5.62 NOREF.6
  Bottom Layer w2.032: 1N5819.2 36.1,21.59 32.64,21.59 29.21,25.02 29.21,36.83 36.83,36.83 FQP30N06L.2
OUTPUT_CONTROL: length 40.1
  Top Layer w0.762: MOSFET RESISTOR.2 31.75,47.01 31.75,41.91 FQP30N06L.1 LED.2
  Bottom Layer w0.762: ATTINY85.6 41.91,36.97 41.91,39.37 39.37,41.91 34.29,41.91 FQP30N06L.1
PULLUP: length 14
  Bottom Layer w0.508: ATTINY85.1 34.96,23.32 37.64,23.32 39.12,21.84 41.68,21.84 10K RESISTOR.2
SIGNAL: length 28
  Top Layer w0.508: v1(31.93,30.84) 31.01,31.75 26.67,31.75 L7805CV#2.3 ; 44.96,31.98 44.45,31.48 NOREF#3.1
  Bottom Layer w0.508: 35.56,27.25 ATTINY85.2 ; 35.56,27.25 35.79,27.48 41.68,27.48 42.49,26.67 NOREF#3.1 ; 35.56,27.25 35.56,27.94 32.66,30.84 v1(31.93,30.84)
TRIGGER: length 34.1
  Bottom Layer w2.54: 20.57,31.76 16.51,31.76 16.51,21.59 21.59,16.51 NOREF#2.3

## Text on the board
Bottom Silkscreen Layer: Delay Module | Board by Max Johnson
Top Silkscreen Layer: - | + | PULLDOWN | MOSFET | CHIP | SIGNAL | PULLUP | TRIGGER | ON TIME | OFF TIME | VCC | GND | OUT+ | OUT-
